# EAGLE design DriverOK-DemuxOK-VIA71 (EAGLE 9.6.2)
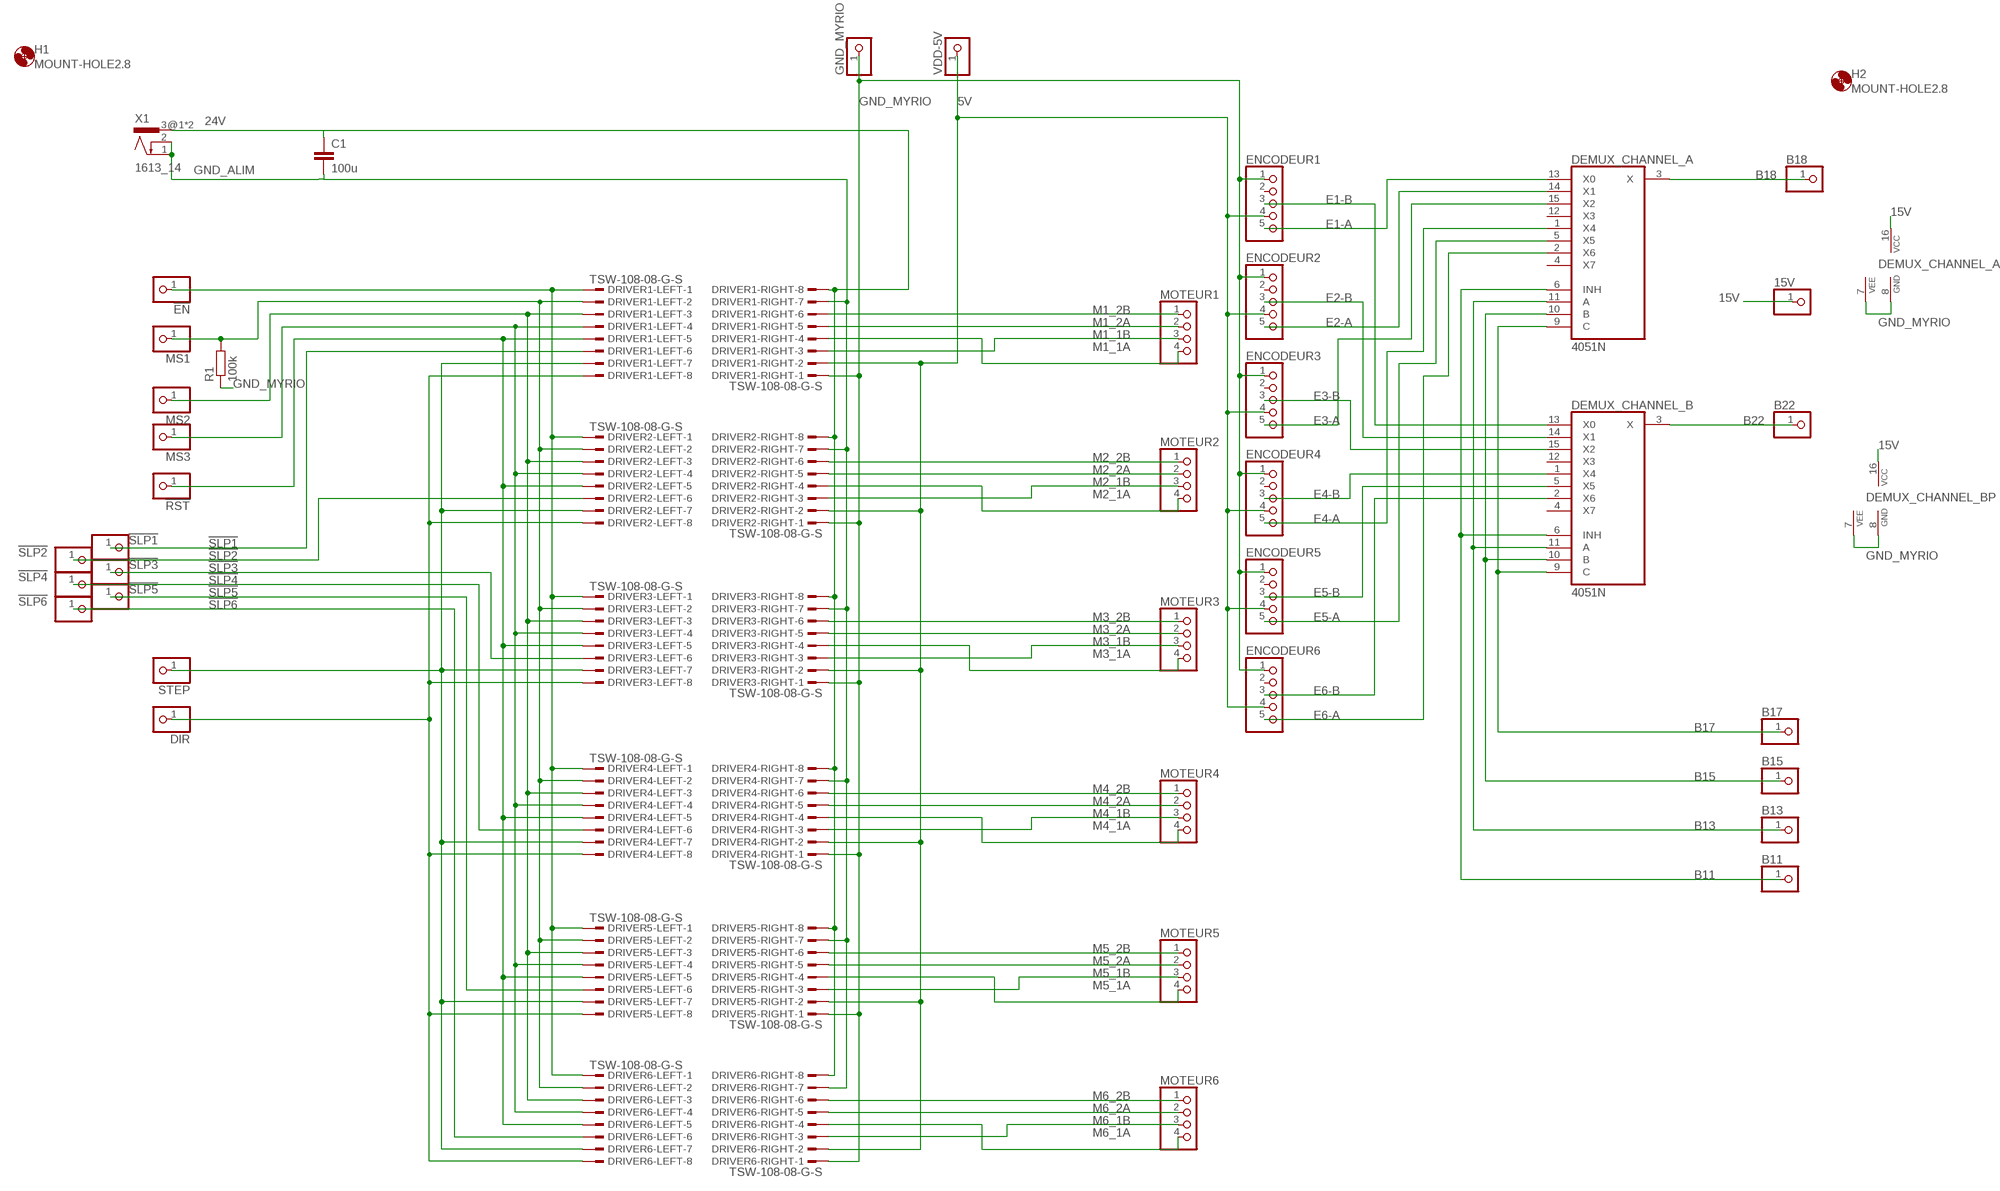
[diagram p0: schematic, sheet 1]

## Parts
15V  PINHD-1X1  [1X01]
!EN  PINHD-1X1  [1X01]
!RST  PINHD-1X1  [1X01]
!SLP1  PINHD-1X1  [1X01]
!SLP2  PINHD-1X1  [1X01]
!SLP3  PINHD-1X1  [1X01]
!SLP4  PINHD-1X1  [1X01]
!SLP5  PINHD-1X1  [1X01]
!SLP6  PINHD-1X1  [1X01]
B11  PINHD-1X1  [1X01]
B13  PINHD-1X1  [1X01]
B15  PINHD-1X1  [1X01]
B17  PINHD-1X1  [1X01]
B18  PINHD-1X1  [1X01]
B22  PINHD-1X1  [1X01]
C1  100u  C-EU025-025X050  [C025-025X050]
DEMUX_CHANNEL_A  4051N  [DIL16]
DEMUX_CHANNEL_B  4051N  [DIL16]
DIR  PINHD-1X1  [1X01]
DRIVER1-LEFT  TSW-108-08-G-S  [TSW-108-XX-G-S]
DRIVER1-RIGHT  TSW-108-08-G-S  [TSW-108-XX-G-S]
DRIVER2-LEFT  TSW-108-08-G-S  [TSW-108-XX-G-S]
DRIVER2-RIGHT  TSW-108-08-G-S  [TSW-108-XX-G-S]
DRIVER3-LEFT  TSW-108-08-G-S  [TSW-108-XX-G-S]
DRIVER3-RIGHT  TSW-108-08-G-S  [TSW-108-XX-G-S]
DRIVER4-LEFT  TSW-108-08-G-S  [TSW-108-XX-G-S]
DRIVER4-RIGHT  TSW-108-08-G-S  [TSW-108-XX-G-S]
DRIVER5-LEFT  TSW-108-08-G-S  [TSW-108-XX-G-S]
DRIVER5-RIGHT  TSW-108-08-G-S  [TSW-108-XX-G-S]
DRIVER6-LEFT  TSW-108-08-G-S  [TSW-108-XX-G-S]
DRIVER6-RIGHT  TSW-108-08-G-S  [TSW-108-XX-G-S]
ENCODEUR1  PINHD-1X5  [1X05]
ENCODEUR2  PINHD-1X5  [1X05]
ENCODEUR3  PINHD-1X5  [1X05]
ENCODEUR4  PINHD-1X5  [1X05]
ENCODEUR5  PINHD-1X5  [1X05]
ENCODEUR6  PINHD-1X5  [1X05]
GND_MYRIO  PINHD-1X1  [1X01]
H1  MOUNT-HOLE2.8  [2,8]
H2  MOUNT-HOLE2.8  [2,8]
MOTEUR1  PINHD-1X4  [1X04]
MOTEUR2  PINHD-1X4  [1X04]
MOTEUR3  PINHD-1X4  [1X04]
MOTEUR4  PINHD-1X4  [1X04]
MOTEUR5  PINHD-1X4  [1X04]
MOTEUR6  PINHD-1X4  [1X04]
MS1  PINHD-1X1  [1X01]
MS2  PINHD-1X1  [1X01]
MS3  PINHD-1X1  [1X01]
R1  100k  R-EU_0207/10  [0207/10]
STEP  PINHD-1X1  [1X01]
VDD-5V  PINHD-1X1  [1X01]
X1  1613_14  [1613_14]

## Nets
5V: DRIVER1-RIGHT.2 DRIVER2-RIGHT.2 DRIVER3-RIGHT.2 DRIVER4-RIGHT.2 DRIVER5-RIGHT.2 DRIVER6-RIGHT.2 ENCODEUR1.4 ENCODEUR2.4 ENCODEUR3.4 ENCODEUR4.4 ENCODEUR5.4 ENCODEUR6.4 VDD-5V.1
15V: 15V.1 DEMUX_CHANNEL_A.16(VCC) DEMUX_CHANNEL_B.16(VCC)
24V: C1.1 DRIVER1-RIGHT.8 DRIVER2-RIGHT.8 DRIVER3-RIGHT.8 DRIVER4-RIGHT.8 DRIVER5-RIGHT.8 DRIVER6-RIGHT.8 X1.3@1 X1.3@2
!ENABLE: !EN.1 DRIVER1-LEFT.1 DRIVER2-LEFT.1 DRIVER3-LEFT.1 DRIVER4-LEFT.1 DRIVER5-LEFT.1 DRIVER6-LEFT.1
!RESET: !RST.1 DRIVER1-LEFT.5 DRIVER2-LEFT.5 DRIVER3-LEFT.5 DRIVER4-LEFT.5 DRIVER5-LEFT.5 DRIVER6-LEFT.5
!SLP1: !SLP1.1 DRIVER1-LEFT.6
!SLP2: !SLP2.1 DRIVER2-LEFT.6
!SLP3: !SLP3.1 DRIVER3-LEFT.6
!SLP4: !SLP4.1 DRIVER4-LEFT.6
!SLP5: !SLP5.1 DRIVER5-LEFT.6
!SLP6: !SLP6.1 DRIVER6-LEFT.6
B11: B11.1 DEMUX_CHANNEL_A.6(INH) DEMUX_CHANNEL_B.6(INH)
B13: B13.1 DEMUX_CHANNEL_A.11(A) DEMUX_CHANNEL_B.11(A)
B15: B15.1 DEMUX_CHANNEL_A.10(B) DEMUX_CHANNEL_B.10(B)
B17: B17.1 DEMUX_CHANNEL_A.9(C) DEMUX_CHANNEL_B.9(C)
B18: B18.1 DEMUX_CHANNEL_A.3(X)
B22: B22.1 DEMUX_CHANNEL_B.3(X)
DIR: DIR.1 DRIVER1-LEFT.8 DRIVER2-LEFT.8 DRIVER3-LEFT.8 DRIVER4-LEFT.8 DRIVER5-LEFT.8 DRIVER6-LEFT.8
E1-A: DEMUX_CHANNEL_A.13(X0) ENCODEUR1.5
E1-B: DEMUX_CHANNEL_B.13(X0) ENCODEUR1.3
E2-A: DEMUX_CHANNEL_A.14(X1) ENCODEUR2.5
E2-B: DEMUX_CHANNEL_B.14(X1) ENCODEUR2.3
E3-A: DEMUX_CHANNEL_A.15(X2) ENCODEUR3.5
E3-B: DEMUX_CHANNEL_B.15(X2) ENCODEUR3.3
E4-A: DEMUX_CHANNEL_A.1(X4) ENCODEUR4.5
E4-B: DEMUX_CHANNEL_B.1(X4) ENCODEUR4.3
E5-A: DEMUX_CHANNEL_A.5(X5) ENCODEUR5.5
E5-B: DEMUX_CHANNEL_B.5(X5) ENCODEUR5.3
E6-A: DEMUX_CHANNEL_A.2(X6) ENCODEUR6.5
E6-B: DEMUX_CHANNEL_B.2(X6) ENCODEUR6.3
GND_ALIM: C1.2 DRIVER1-RIGHT.7 DRIVER2-RIGHT.7 DRIVER3-RIGHT.7 DRIVER4-RIGHT.7 DRIVER5-RIGHT.7 DRIVER6-RIGHT.7 X1.1 X1.2
GND_MYRIO: DEMUX_CHANNEL_A.7(VEE) DEMUX_CHANNEL_A.8(GND) DEMUX_CHANNEL_B.7(VEE) DEMUX_CHANNEL_B.8(GND) DRIVER1-RIGHT.1 DRIVER2-RIGHT.1 DRIVER3-RIGHT.1 DRIVER4-RIGHT.1 DRIVER5-RIGHT.1 DRIVER6-RIGHT.1 ENCODEUR1.1 ENCODEUR2.1 ENCODEUR3.1 ENCODEUR4.1 ENCODEUR5.1 ENCODEUR6.1 GND_MYRIO.1 R1.1
M1_1A: DRIVER1-RIGHT.4 MOTEUR1.4
M1_1B: DRIVER1-RIGHT.3 MOTEUR1.3
M1_2A: DRIVER1-RIGHT.5 MOTEUR1.2
M1_2B: DRIVER1-RIGHT.6 MOTEUR1.1
M2_1A: DRIVER2-RIGHT.4 MOTEUR2.4
M2_1B: DRIVER2-RIGHT.3 MOTEUR2.3
M2_2A: DRIVER2-RIGHT.5 MOTEUR2.2
M2_2B: DRIVER2-RIGHT.6 MOTEUR2.1
M3_1A: DRIVER3-RIGHT.4 MOTEUR3.4
M3_1B: DRIVER3-RIGHT.3 MOTEUR3.3
M3_2A: DRIVER3-RIGHT.5 MOTEUR3.2
M3_2B: DRIVER3-RIGHT.6 MOTEUR3.1
M4_1A: DRIVER4-RIGHT.4 MOTEUR4.4
M4_1B: DRIVER4-RIGHT.3 MOTEUR4.3
M4_2A: DRIVER4-RIGHT.5 MOTEUR4.2
M4_2B: DRIVER4-RIGHT.6 MOTEUR4.1
M5_1A: DRIVER5-RIGHT.4 MOTEUR5.4
M5_1B: DRIVER5-RIGHT.3 MOTEUR5.3
M5_2A: DRIVER5-RIGHT.5 MOTEUR5.2
M5_2B: DRIVER5-RIGHT.6 MOTEUR5.1
M6_1A: DRIVER6-RIGHT.4 MOTEUR6.4
M6_1B: DRIVER6-RIGHT.3 MOTEUR6.3
M6_2A: DRIVER6-RIGHT.5 MOTEUR6.2
M6_2B: DRIVER6-RIGHT.6 MOTEUR6.1
MS1: DRIVER1-LEFT.2 DRIVER2-LEFT.2 DRIVER3-LEFT.2 DRIVER4-LEFT.2 DRIVER5-LEFT.2 DRIVER6-LEFT.2 MS1.1 R1.2
MS2: DRIVER1-LEFT.3 DRIVER2-LEFT.3 DRIVER3-LEFT.3 DRIVER4-LEFT.3 DRIVER5-LEFT.3 DRIVER6-LEFT.3 MS2.1
MS3: DRIVER1-LEFT.4 DRIVER2-LEFT.4 DRIVER3-LEFT.4 DRIVER4-LEFT.4 DRIVER5-LEFT.4 DRIVER6-LEFT.4 MS3.1
STEP: DRIVER1-LEFT.7 DRIVER2-LEFT.7 DRIVER3-LEFT.7 DRIVER4-LEFT.7 DRIVER5-LEFT.7 DRIVER6-LEFT.7 STEP.1
Unconnected: DEMUX_CHANNEL_A.4(X7) DEMUX_CHANNEL_A.12(X3) DEMUX_CHANNEL_B.4(X7) DEMUX_CHANNEL_B.12(X3) ENCODEUR1.2 ENCODEUR2.2 ENCODEUR3.2 ENCODEUR4.2 ENCODEUR5.2 ENCODEUR6.2

## Library data of the parts
15V !EN !RST !SLP1-!SLP6 B11 B13 B15 B17 B18 B22 DIR GND_MYRIO MS1-MS3 STEP VDD-5V = pinhead:PINHD-1X1: PIN HEADER
C1 = rcl:C-EU: CAPACITOR, European symbol; SPICEPREFIX: C
DEMUX_CHANNEL_A DEMUX_CHANNEL_B = 40xx:4051: 8-channel ANALOG MULTIPLEXER
DRIVER1-LEFT DRIVER1-RIGHT DRIVER2-LEFT DRIVER2-RIGHT DRIVER3-LEFT DRIVER3-RIGHT DRIVER4-LEFT DRIVER4-RIGHT DRIVER5-LEFT DRIVER5-RIGHT DRIVER6-LEFT DRIVER6-RIGHT = con-samtec:TSW-108-*-G-S: THROUGH-HOLE .025" SQ POST HEADER Source: Samtec TSW.pdf; MF: Samtec Inc.; MPN: TSW-108-07-G-S
ENCODEUR1-ENCODEUR6 = pinhead:PINHD-1X5: PIN HEADER
H1 H2 = holes:MOUNT-HOLE: MOUNTING HOLE with drill center marker
MOTEUR1-MOTEUR6 = pinhead:PINHD-1X4: PIN HEADER
R1 = rcl:R-EU_: RESISTOR, European symbol; SPICEPREFIX: R
X1 = con-lumberg:1613_14: Power supply connectors / Netzgeräte-Steckverbinder Source: Data sheet <http://www.farnell.com/datasheets/1733496.pdf>; MF: LUMBERG; MPN: 1613 14; OC_FARNELL: 1243245

## Board
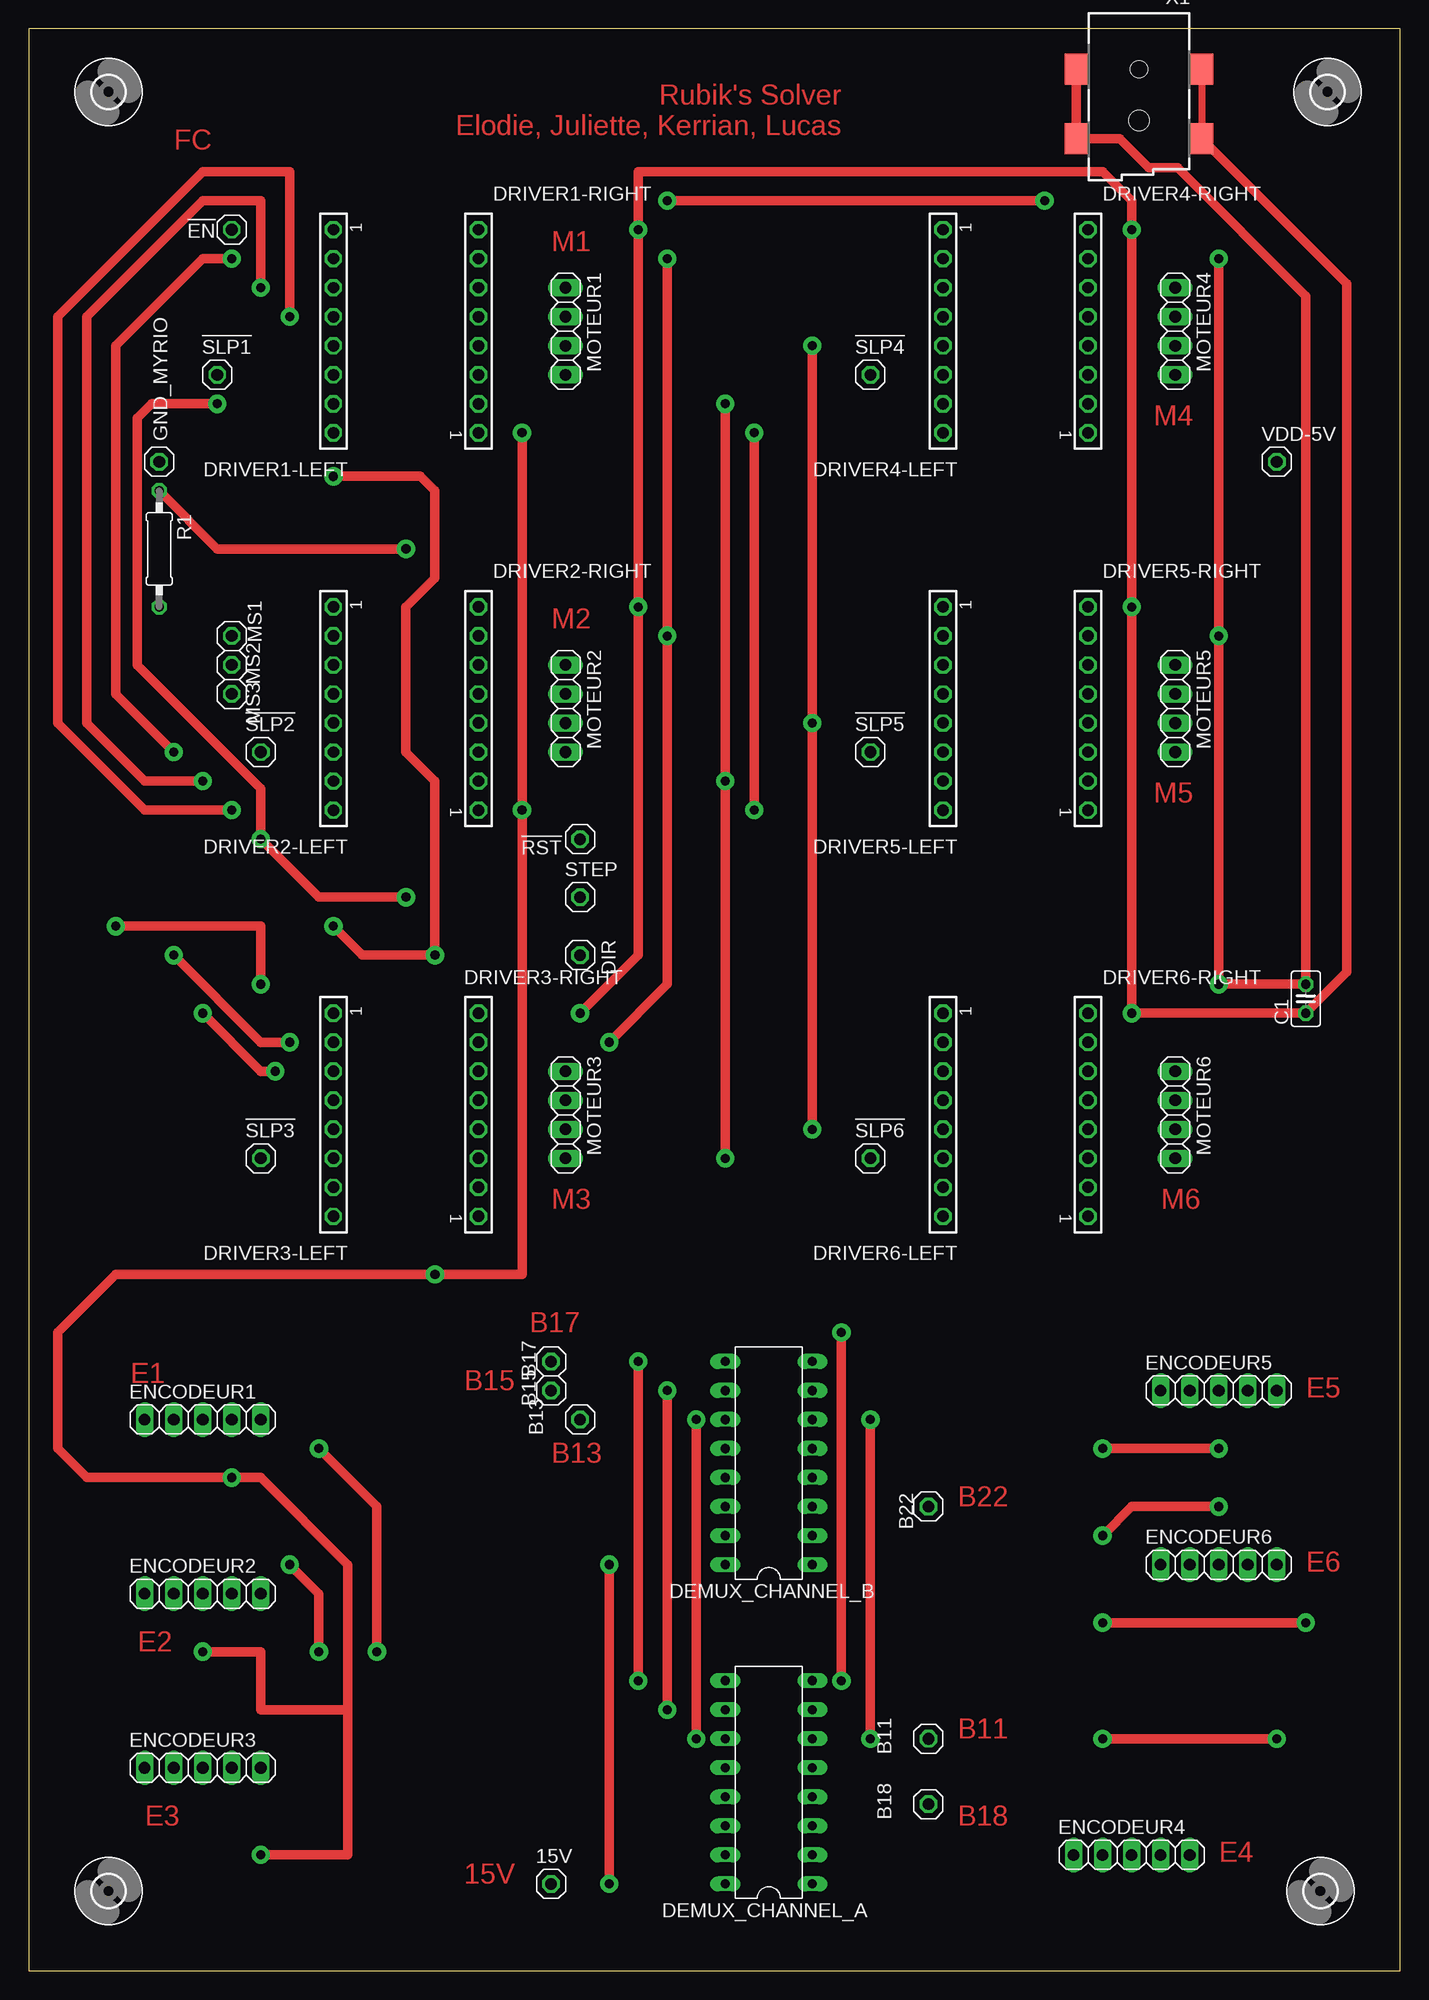
[diagram p1: board, top side]
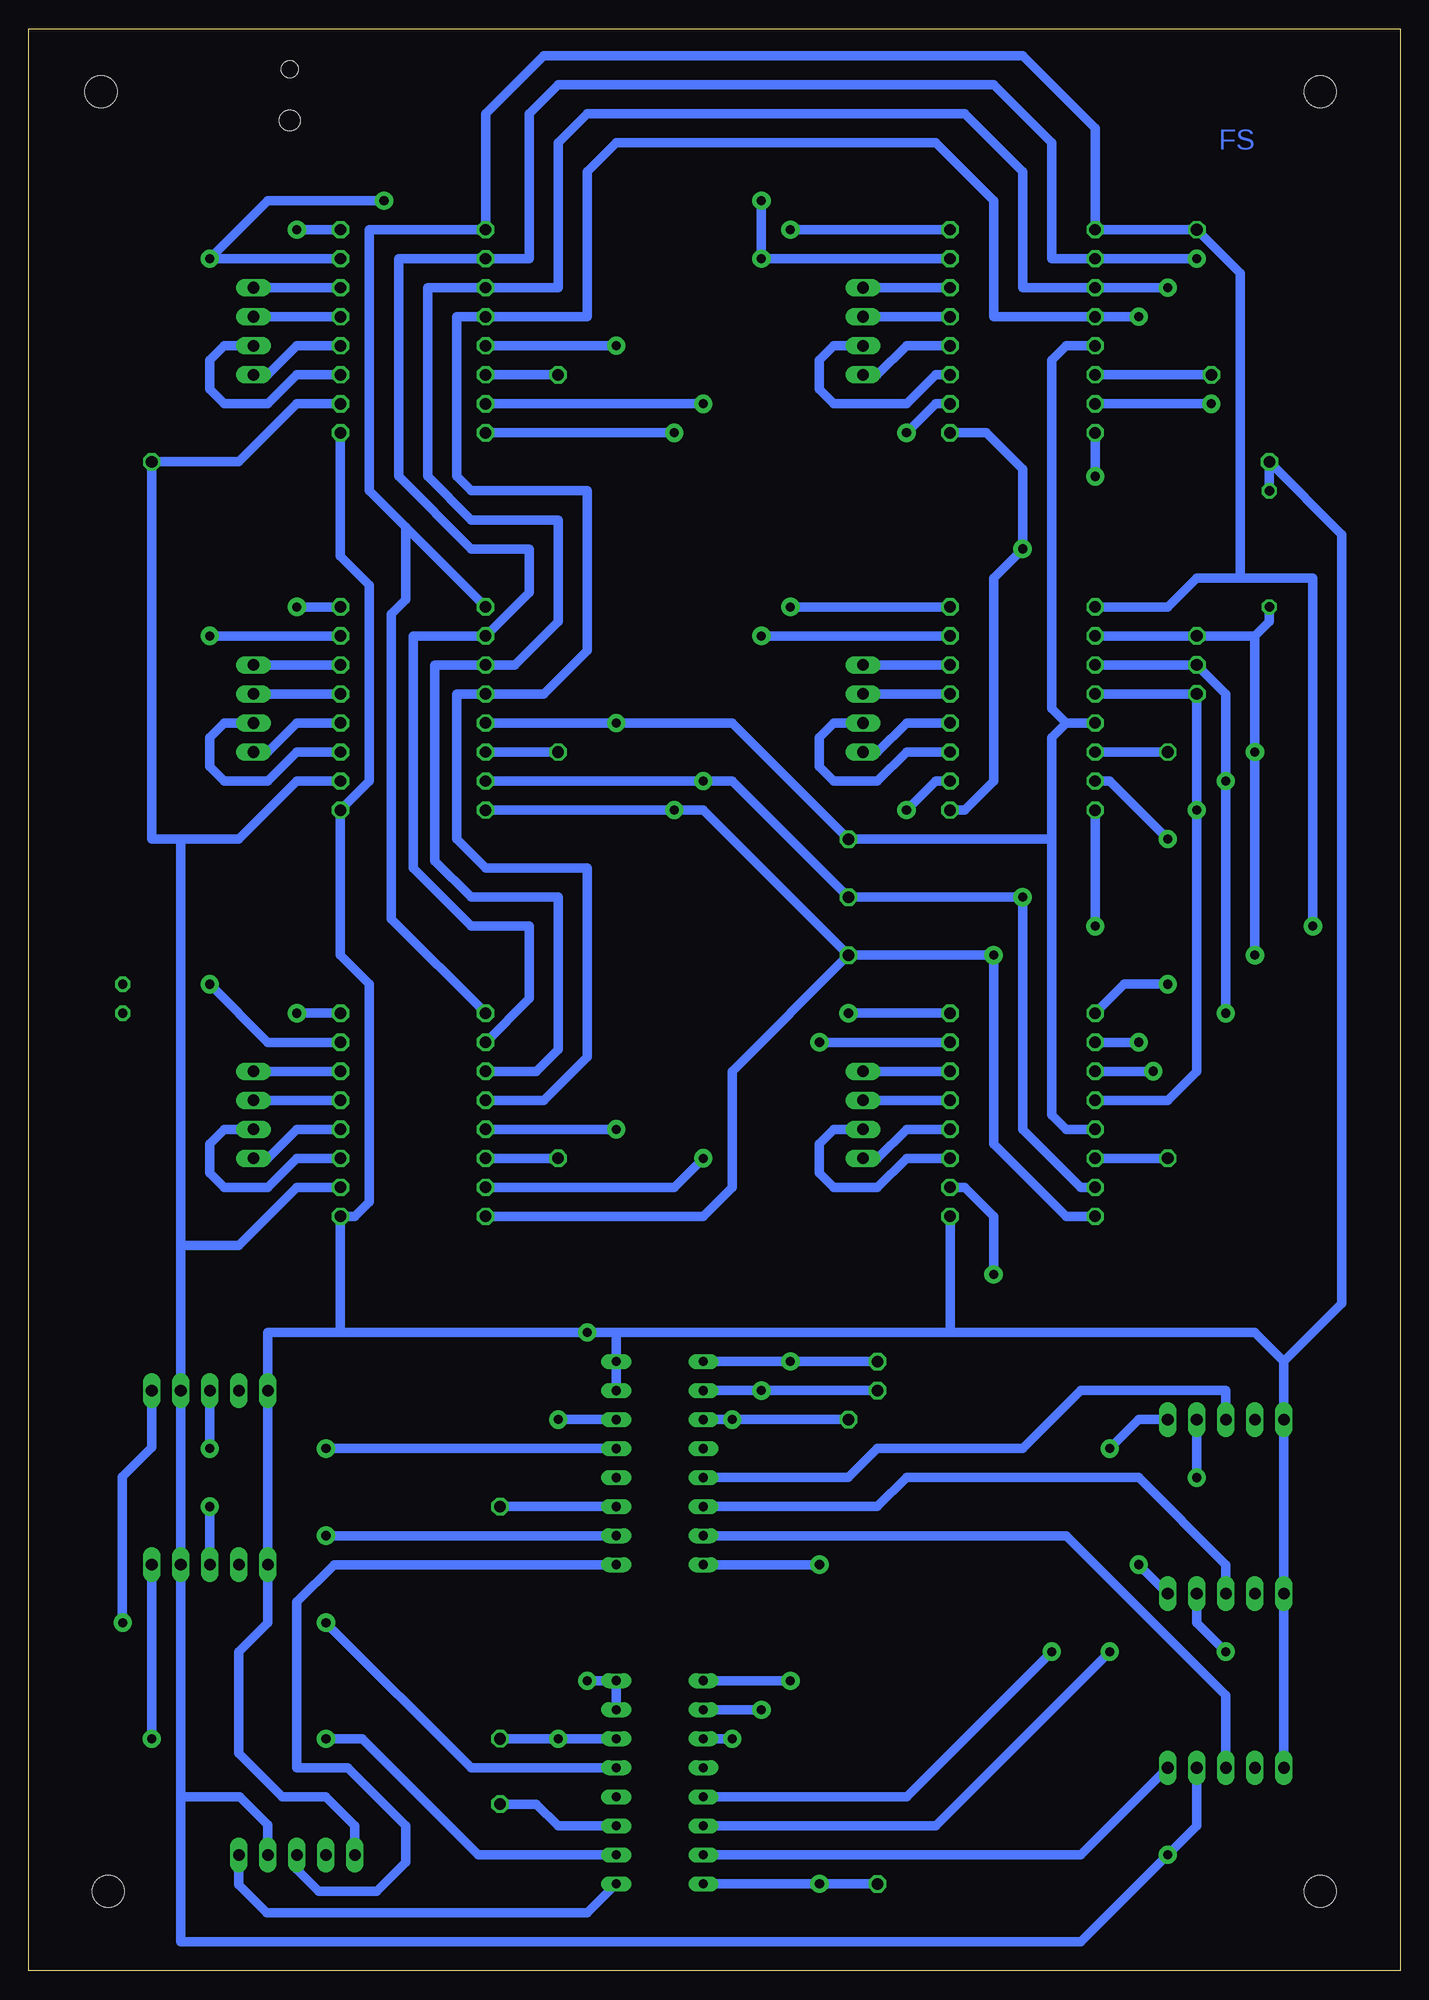
[diagram p2: board, bottom side, seen from below]

Size 120 x 170 mm. Coordinates in mm from the lower left corner, seen from the top.
Outline: 0,0 120,0 120,170 0,170 0,0
Copper layers (1*16): Top 0.035mm / dielectric 1.5mm / Bottom 0.035mm
Design rules "default": minimum track width 6mil, minimum drill 0.35mm, track to track 6mil, track to pad 6mil, pad to pad 6mil, via to via 6mil, smd to smd 6mil, copper to edge 40mil, drill to drill 6mil, minimum pad ring 10mil, minimum via ring 8mil, stop-mask expansion 4mil, vias tented up to drill 0mil, thermal gap 10mil

### Footprints (pad centres in the part's own frame; a part is rotated, then mirrored left to right if it is on the bottom)
1X01 = drill 1.016 octagon: 1 0,0
C025-025X050 = drill 0.813 octagon: 1 -1.27,0; 2 1.27,0
DIL16 = drill 0.813 long: 1 -8.89,-3.81; 2 -6.35,-3.81; 3 -3.81,-3.81; 4 -1.27,-3.81; 5 1.27,-3.81; 6 3.81,-3.81; 7 6.35,-3.81; 8 8.89,-3.81; 9 8.89,3.81; 10 6.35,3.81; 11 3.81,3.81; 12 1.27,3.81; 13 -1.27,3.81; 14 -3.81,3.81; 15 -6.35,3.81; 16 -8.89,3.81
TSW-108-XX-G-S = drill 1 pad 1.5 octagon: 1 8.89,0; 2 6.35,0; 3 3.81,0; 4 1.27,0; 5 -1.27,0; 6 -3.81,0; 7 -6.35,0; 8 -8.89,0
1X05 = drill 1.016 long: 1 -5.08,0; 2 -2.54,0; 3 0,0; 4 2.54,0; 5 5.08,0
2,8 = hole 2.8: 0,0
1X04 = drill 1.016 long: 1 -3.81,0; 2 -1.27,0; 3 1.27,0; 4 3.81,0
0207/10 = drill 0.813 octagon: 1 -5.08,0; 2 5.08,0
1613_14 = smd 2 x 2.7: 1 5.5,5; 2 5.5,11.1; 3@1 -5.5,11.1; 3@2 -5.5,5 | hole 1.5: 0,5 | hole 1.8: 0,9.5

### Placement (x,y rotation side)
15V  45.72,7.62 0 top
!EN  17.78,152.4 270 top
!RST  48.26,99.06 0 top
!SLP1  16.51,139.7 0 top
!SLP2  20.32,106.68 0 top
!SLP3  20.32,71.12 0 top
!SLP4  73.66,139.7 0 top
!SLP5  73.66,106.68 0 top
!SLP6  73.66,71.12 0 top
B11  78.74,20.32 0 top
B13  48.26,48.26 0 top
B15  45.72,50.8 0 top
B17  45.72,53.34 0 top
B18  78.74,14.61 0 top
B22  78.74,40.64 0 top
C1  111.76,85.09 90 top
DEMUX_CHANNEL_A  64.77,16.51 90 top
DEMUX_CHANNEL_B  64.77,44.45 90 top
DIR  48.26,88.9 270 top
DRIVER1-LEFT  26.67,143.51 90 top
DRIVER1-RIGHT  39.37,143.51 270 top
DRIVER2-LEFT  26.67,110.49 90 top
DRIVER2-RIGHT  39.37,110.49 270 top
DRIVER3-LEFT  26.67,74.93 90 top
DRIVER3-RIGHT  39.37,74.93 270 top
DRIVER4-LEFT  80.01,143.51 90 top
DRIVER4-RIGHT  92.71,143.51 270 top
DRIVER5-LEFT  80.01,110.49 90 top
DRIVER5-RIGHT  92.71,110.49 270 top
DRIVER6-LEFT  80.01,74.93 90 top
DRIVER6-RIGHT  92.71,74.93 270 top
ENCODEUR1  15.24,48.26 0 top
ENCODEUR2  15.24,33.02 0 top
ENCODEUR3  15.24,17.78 0 top
ENCODEUR4  96.52,10.16 0 top
ENCODEUR5  104.14,50.8 0 top
ENCODEUR6  104.14,35.56 0 top
GND_MYRIO  11.43,132.08 90 top
H1  6.99,164.47 0 top
H2  6.99,6.99 0 top
H3  MOUNT-HOLE2.8  [2,8]  113.67,164.47 0 top
H4  MOUNT-HOLE2.8  [2,8]  113.03,6.99 0 top
MOTEUR1  46.99,143.51 270 top
MOTEUR2  46.99,110.49 270 top
MOTEUR3  46.99,74.93 270 top
MOTEUR4  100.33,143.51 270 top
MOTEUR5  100.33,110.49 270 top
MOTEUR6  100.33,74.93 270 top
MS1  17.78,116.84 270 top
MS2  17.78,114.3 270 top
MS3  17.78,111.76 270 top
R1  11.43,124.46 270 top
STEP  48.26,93.98 0 top
VDD-5V  109.22,132.08 0 top
X1  97.16,171.45 180 top

### Tracks (layer width: path | path; a pad name or v marks a point on that pad's centre or on a via)
5V  (via drill 0.8 pad 1.6)
  Top 0.813: v20.32,10.16 27.94,10.16 27.94,22.86 | 27.94,22.86 27.94,35.56 20.32,43.18 v17.78,43.18 5.08,43.18 2.54,45.72 2.54,55.88 7.62,60.96 v35.56,60.96 43.18,60.96 v43.18,101.6 v43.18,134.62 | v15.24,27.94 20.32,27.94 20.32,22.86 27.94,22.86
  Bottom 0.813: ENCODEUR3.4 17.78,12.7 v20.32,10.16 27.94,2.54 106.68,2.54 106.68,15.24 | ENCODEUR1.4 v17.78,43.18 | ENCODEUR2.4 17.78,30.48 v15.24,27.94 | DRIVER4-RIGHT.2 96.52,137.16 101.6,132.08 VDD-5V.1 109.22,99.06 106.68,99.06 | 106.68,99.06 101.6,99.06 96.52,104.14 DRIVER5-RIGHT.2 | 106.68,99.06 106.68,63.5 | 106.68,63.5 101.6,63.5 96.52,68.58 DRIVER6-RIGHT.2 | v35.56,60.96 35.56,66.04 38.1,68.58 DRIVER3-RIGHT.2 | v43.18,101.6 40.64,104.14 DRIVER2-RIGHT.2 | v43.18,134.62 40.64,137.16 DRIVER1-RIGHT.2 | 106.68,15.24 ENCODEUR6.4 ENCODEUR5.4 106.68,63.5 | ENCODEUR4.4 99.06,12.79 101.51,15.24 106.68,15.24
15V  (via drill 0.8 pad 1.6)
  Top 0.813: v50.8,7.62 v50.8,35.56
  Bottom 0.813: 15V.1 v50.8,7.62 DEMUX_CHANNEL_A.16 | v50.8,35.56 DEMUX_CHANNEL_B.16
24V  (via drill 0.8 pad 1.6)
  Top 0.61: X1.3@2 X1.3@1
  Top 0.813: X1.3@1 115.36,147.65 115.36,87.42 C1.1 v96.52,83.82 v96.52,119.38 v96.52,152.4 96.52,154.94 93.98,157.48 53.34,157.48 v53.34,152.4 v53.34,119.38 53.34,88.9 v48.26,83.82
  Bottom 0.813: v96.52,83.82 DRIVER6-RIGHT.8 | v96.52,152.4 DRIVER4-RIGHT.8 | v96.52,119.38 DRIVER5-RIGHT.8 | v53.34,152.4 DRIVER1-RIGHT.8 | v48.26,83.82 DRIVER3-RIGHT.8 | v53.34,119.38 DRIVER2-RIGHT.8
!ENABLE  (via drill 0.8 pad 1.6)
  Top 0.813: v7.62,91.44 20.32,91.44 v20.32,86.36
  Bottom 0.813: 13.97,121.92 13.97,148.59 !EN.1 DRIVER1-LEFT.1 26.67,161.29 33.02,167.64 74.93,167.64 80.01,162.56 DRIVER4-LEFT.1 90.17,152.4 90.17,129.54 87,126.36 | DRIVER2-LEFT.1 20.32,119.38 17.78,121.92 13.97,121.92 | 13.97,121.92 7.62,121.92 v7.62,91.44 | v20.32,86.36 24.13,86.36 DRIVER3-LEFT.1 | 87,126.36 DRIVER5-LEFT.1 | 87,126.36 87,120.02 88.27,118.75 88.27,92.08 DRIVER6-LEFT.1
!RESET  (via drill 0.8 pad 1.6)
  Top 0.813: v68.58,73.66 v68.58,109.22 v68.58,142.24
  Bottom 0.813: DRIVER3-LEFT.5 29.21,73.66 30.48,74.93 30.48,99.06 | 30.48,99.06 30.48,107.95 29.21,109.22 | DRIVER2-LEFT.5 29.21,109.22 | 29.21,109.22 30.48,110.49 30.48,140.97 29.21,142.24 DRIVER1-LEFT.5 | 30.48,99.06 !RST.1 58.42,109.22 v68.58,109.22 DRIVER5-LEFT.5 | v68.58,73.66 DRIVER6-LEFT.5 | v68.58,142.24 DRIVER4-LEFT.5
!SLP1
  Bottom 0.813: !SLP1.1 DRIVER1-LEFT.6
!SLP2
  Bottom 0.813: !SLP2.1 DRIVER2-LEFT.6
!SLP3
  Bottom 0.813: !SLP3.1 DRIVER3-LEFT.6
!SLP4
  Bottom 0.813: !SLP4.1 DRIVER4-LEFT.6
!SLP5
  Bottom 0.813: !SLP5.1 DRIVER5-LEFT.6
!SLP6
  Bottom 0.813: !SLP6.1 DRIVER6-LEFT.6
B11  (via drill 0.8 pad 1.6)
  Top 0.813: v73.66,20.32 v73.66,48.26
  Bottom 0.813: DEMUX_CHANNEL_A.6 v73.66,20.32 B11.1 | v73.66,48.26 DEMUX_CHANNEL_B.6
B13  (via drill 0.8 pad 1.6)
  Top 0.813: v58.42,48.26 v58.42,20.32
  Bottom 0.813: DEMUX_CHANNEL_B.11 v58.42,48.26 B13.1 | v58.42,20.32 DEMUX_CHANNEL_A.11
B15  (via drill 0.8 pad 1.6)
  Top 0.813: v55.88,50.8 v55.88,22.86
  Bottom 0.813: DEMUX_CHANNEL_B.10 v55.88,50.8 B15.1 | v55.88,22.86 DEMUX_CHANNEL_A.10
B17  (via drill 0.8 pad 1.6)
  Top 0.813: v53.34,53.34 v53.34,25.4
  Bottom 0.813: DEMUX_CHANNEL_B.9 v53.34,53.34 B17.1 | v53.34,25.4 DEMUX_CHANNEL_A.9
B18
  Bottom 0.813: DEMUX_CHANNEL_A.3 73.66,12.7 75.56,14.61 B18.1
B22
  Bottom 0.813: DEMUX_CHANNEL_B.3 B22.1
DIR  (via drill 0.8 pad 1.6)
  Top 0.813: v26.67,91.44 29.21,88.9 v35.56,88.9 35.56,104.14 33.02,106.68 33.02,119.38 35.56,121.92 35.56,129.54 34.29,130.81 v26.67,130.81 | v63.5,101.6 v63.5,134.62
  Bottom 0.813: DIR.1 v35.56,88.9 35.56,72.39 29.21,66.04 DRIVER3-LEFT.8 | DIR.1 60.96,101.6 v63.5,101.6 DRIVER5-LEFT.8 | DIR.1 58.42,78.74 58.42,68.58 60.96,66.04 DRIVER6-LEFT.8 | v26.67,91.44 DRIVER2-LEFT.8 | v26.67,130.81 DRIVER1-LEFT.8 | v63.5,134.62 DRIVER4-LEFT.8
E1-A  (via drill 0.8 pad 1.6)
  Top 0.813: v25.4,45.72 30.48,40.64 v30.48,27.94
  Bottom 0.813: ENCODEUR1.5 22.86,48.26 v25.4,45.72 | v30.48,27.94 43.18,15.24 DEMUX_CHANNEL_A.13
E1-B
  Bottom 0.813: ENCODEUR1.3 15.24,50.8 27.94,50.8 33.02,45.72 45.72,45.72 48.26,43.18 DEMUX_CHANNEL_B.13
E2-A  (via drill 0.8 pad 1.6)
  Top 0.813: v22.86,35.56 25.4,33.02 v25.4,27.94
  Bottom 0.813: ENCODEUR2.5 v22.86,35.56 | v25.4,27.94 40.64,12.7 DEMUX_CHANNEL_A.14
E2-B
  Bottom 0.813: ENCODEUR2.3 15.24,35.56 22.86,43.18 43.18,43.18 45.72,40.64 DEMUX_CHANNEL_B.14
E3-A
  Bottom 0.813: ENCODEUR3.5 27.94,10.16 DEMUX_CHANNEL_A.15
E3-B
  Bottom 0.813: ENCODEUR3.3 15.24,24.13 29.21,38.1 DEMUX_CHANNEL_B.15
E4-A
  Bottom 0.813: DEMUX_CHANNEL_A.1 71.12,5.08 99.15,5.08 101.6,7.53 ENCODEUR4.5
E4-B
  Bottom 0.813: DEMUX_CHANNEL_B.1 93.25,35.56 96.52,32.29 96.52,17.78 92.08,17.78 87,12.7 87,9.53 89.53,6.99 94.61,6.99 96.52,8.89 ENCODEUR4.3
E5-A  (via drill 0.8 pad 1.6)
  Top 0.813: v93.98,30.48 v111.76,30.48
  Bottom 0.813: v93.98,30.48 81.28,17.78 DEMUX_CHANNEL_A.5 | ENCODEUR5.5 109.22,45.81 111.81,43.22 111.81,30.53 v111.76,30.48
E5-B  (via drill 0.8 pad 1.6)
  Top 0.813: v93.98,45.72 v104.14,45.72
  Bottom 0.813: DEMUX_CHANNEL_B.5 v93.98,45.72 | ENCODEUR5.3 v104.14,45.72
E6-A  (via drill 0.8 pad 1.6)
  Top 0.813: v93.98,20.32 v109.22,20.32
  Bottom 0.813: v93.98,20.32 90.81,20.32 80.64,10.16 DEMUX_CHANNEL_A.2 | v109.22,20.32 ENCODEUR6.5
E6-B  (via drill 0.8 pad 1.6)
  Top 0.813: v104.14,40.64 96.52,40.64 v93.98,38.1
  Bottom 0.813: DEMUX_CHANNEL_B.2 v93.98,38.1 | ENCODEUR6.3 v104.14,40.64
GND_ALIM  (via drill 0.8 pad 1.6)
  Top 0.813: X1.1 X1.2 95.47,160.35 98,157.81 100.55,157.81 111.76,146.59 C1.2 v104.14,86.36 v104.14,116.84 v104.14,149.86 | v50.8,81.28 55.88,86.36 v55.88,116.84 v55.88,149.86 | v88.9,154.94 v55.88,154.94
  Bottom 0.813: v104.14,86.36 99.06,81.28 DRIVER6-RIGHT.7 | DRIVER4-RIGHT.7 v104.14,149.86 99.06,154.94 v88.9,154.94 | v104.14,116.84 DRIVER5-RIGHT.7 | v55.88,154.94 v55.88,149.86 DRIVER1-RIGHT.7 | v55.88,116.84 DRIVER2-RIGHT.7 | v50.8,81.28 DRIVER3-RIGHT.7
GND_MYRIO  (via drill 0.8 pad 1.6)
  Top 0.813: v71.12,25.4 v71.12,55.88 | R1.1 16.51,124.46 v33.02,124.46
  Bottom 0.813: ENCODEUR3.1 ENCODEUR2.1 ENCODEUR1.1 10.16,53.34 | 10.16,53.34 12.7,55.88 39.37,55.88 | 39.37,55.88 68.58,55.88 | 68.58,55.88 v71.12,55.88 92.71,55.88 | DEMUX_CHANNEL_B.7 DEMUX_CHANNEL_B.8 68.58,55.88 | DEMUX_CHANNEL_A.7 DEMUX_CHANNEL_A.8 v71.12,25.4 | R1.1 GND_MYRIO.1 5.08,125.73 5.08,58.42 10.16,53.34 | 92.71,55.88 DRIVER6-RIGHT.1 91.44,66.04 90.17,67.31 90.17,86.36 92.71,88.9 DRIVER5-RIGHT.1 90.17,104.14 90.17,121.28 92.71,123.83 DRIVER4-RIGHT.1 | DRIVER3-RIGHT.1 39.37,55.88 | DRIVER1-RIGHT.1 36.2,134.62 33.02,131.44 v33.02,124.46 35.56,121.92 35.56,104.14 38.1,101.6 DRIVER2-RIGHT.1 | 92.71,55.88 99.06,55.88 ENCODEUR5.1 ENCODEUR6.1 99.06,30.48 101.6,27.94 101.6,19.05 97.79,15.24 93.98,15.24 91.44,12.7 ENCODEUR4.1
M1_1A
  Bottom 0.813: DRIVER1-RIGHT.4 43.18,142.24 45.72,139.7 MOTEUR1.4
M1_1B
  Bottom 0.813: DRIVER1-RIGHT.3 40.64,139.7 43.18,137.16 49.53,137.16 50.8,138.43 50.8,140.97 49.53,142.24 MOTEUR1.3
M1_2A
  Bottom 0.813: DRIVER1-RIGHT.5 MOTEUR1.2
M1_2B
  Bottom 0.813: DRIVER1-RIGHT.6 MOTEUR1.1
M2_1A
  Bottom 0.813: DRIVER2-RIGHT.4 43.18,109.22 45.72,106.68 MOTEUR2.4
M2_1B
  Bottom 0.813: DRIVER2-RIGHT.3 43.18,106.68 45.72,104.14 49.53,104.14 50.8,105.41 50.8,107.95 49.53,109.22 MOTEUR2.3
M2_2A
  Bottom 0.813: DRIVER2-RIGHT.5 MOTEUR2.2
M2_2B
  Bottom 0.813: DRIVER2-RIGHT.6 MOTEUR2.1
M3_1A
  Bottom 0.813: DRIVER3-RIGHT.4 43.18,73.66 45.72,71.12 MOTEUR3.4
M3_1B
  Bottom 0.813: DRIVER3-RIGHT.3 43.18,71.12 45.72,68.58 49.53,68.58 50.8,69.85 50.8,72.39 49.53,73.66 MOTEUR3.3
M3_2A
  Bottom 0.813: DRIVER3-RIGHT.5 MOTEUR3.2
M3_2B
  Bottom 0.813: DRIVER3-RIGHT.6 MOTEUR3.1
M4_1A
  Bottom 0.813: MOTEUR4.4 99.06,139.7 96.52,142.24 DRIVER4-RIGHT.4
M4_1B
  Bottom 0.813: DRIVER4-RIGHT.3 96.52,139.7 99.06,137.16 102.87,137.16 104.14,138.43 104.14,140.97 102.87,142.24 MOTEUR4.3
M4_2A
  Bottom 0.813: DRIVER4-RIGHT.5 MOTEUR4.2
M4_2B
  Bottom 0.813: DRIVER4-RIGHT.6 MOTEUR4.1
M5_1A
  Bottom 0.813: DRIVER5-RIGHT.4 96.52,109.22 99.06,106.68 MOTEUR5.4
M5_1B
  Bottom 0.813: DRIVER5-RIGHT.3 96.52,106.68 99.06,104.14 102.87,104.14 104.14,105.41 104.14,107.95 102.87,109.22 MOTEUR5.3
M5_2A
  Bottom 0.813: DRIVER5-RIGHT.5 MOTEUR5.2
M5_2B
  Bottom 0.813: DRIVER5-RIGHT.6 MOTEUR5.1
M6_1A
  Bottom 0.813: MOTEUR6.4 99.06,71.12 96.52,73.66 DRIVER6-RIGHT.4
M6_1B
  Bottom 0.813: DRIVER6-RIGHT.3 96.52,71.12 99.06,68.58 102.87,68.58 104.14,69.85 104.14,72.39 102.87,73.66 MOTEUR6.3
M6_2A
  Bottom 0.813: DRIVER6-RIGHT.5 MOTEUR6.2
M6_2B
  Bottom 0.813: DRIVER6-RIGHT.6 MOTEUR6.1
MS1  (via drill 0.8 pad 1.6)
  Top 0.813: v12.7,88.9 20.32,81.28 v22.86,81.28 | v12.7,106.68 7.62,111.76 7.62,142.24 15.24,149.86 v17.78,149.86
  Bottom 0.813: R1.2 11.43,118.11 12.7,116.84 | 12.7,116.84 MS1.1 DRIVER2-LEFT.2 | DRIVER3-LEFT.2 v22.86,81.28 | 12.7,116.84 v12.7,106.68 v12.7,88.9 | v17.78,149.86 DRIVER1-LEFT.2 30.48,149.86 30.48,160.02 35.56,165.1 73.66,165.1 76.2,162.56 76.2,149.86 DRIVER4-LEFT.2 87.63,149.86 87.63,130.81 81.28,124.46 76.2,124.46 76.2,120.65 DRIVER5-LEFT.2 86.36,116.84 86.36,96.52 81.28,91.44 76.2,91.44 76.2,85.09 DRIVER6-LEFT.2
MS2  (via drill 0.8 pad 1.6)
  Top 0.813: v15.24,83.82 20.32,78.74 v21.59,78.74 | v15.24,104.14 10.16,104.14 5.08,109.22 5.08,144.78 15.24,154.94 20.32,154.94 v20.32,147.32
  Bottom 0.813: DRIVER2-LEFT.3 MS2.1 15.24,111.76 v15.24,104.14 v15.24,83.82 | DRIVER3-LEFT.3 v21.59,78.74 | v20.32,147.32 DRIVER1-LEFT.3 33.02,147.32 33.02,157.48 38.1,162.56 71.12,162.56 73.66,160.02 73.66,147.32 DRIVER4-LEFT.3 85.09,147.32 85.09,130.81 81.28,127 73.66,127 73.66,118.11 77.47,114.3 DRIVER5-LEFT.3 84.45,114.3 84.45,97.16 81.28,93.98 73.66,93.98 73.66,80.64 75.56,78.74 DRIVER6-LEFT.3
MS3  (via drill 0.8 pad 1.6)
  Top 0.813: v17.78,101.6 10.16,101.6 2.54,109.22 2.54,144.78 15.24,157.48 22.86,157.48 v22.86,144.78
  Bottom 0.813: DRIVER2-LEFT.4 MS3.1 v17.78,101.6 17.78,78.74 20.32,76.2 DRIVER3-LEFT.4 | v22.86,144.78 DRIVER1-LEFT.4 35.56,144.78 35.56,154.94 40.64,160.02 68.58,160.02 71.12,157.48 71.12,144.78 DRIVER4-LEFT.4 82.55,144.78 82.55,130.81 81.28,129.54 71.12,129.54 71.12,115.57 74.93,111.76 DRIVER5-LEFT.4 82.55,111.76 82.55,99.06 80.01,96.52 71.12,96.52 71.12,80.01 74.93,76.2 DRIVER6-LEFT.4
STEP  (via drill 0.8 pad 1.6)
  Top 0.813: v33.02,93.98 25.4,93.98 v20.32,99.06 20.32,103.5 9.53,114.3 9.53,135.89 10.79,137.16 v16.51,137.16 | v60.96,137.16 v60.96,104.14 v60.96,71.12
  Bottom 0.813: DRIVER3-LEFT.7 27.94,68.58 33.02,73.66 v33.02,93.98 STEP.1 58.42,104.14 v60.96,104.14 DRIVER5-LEFT.7 | v20.32,99.06 25.4,104.14 DRIVER2-LEFT.7 | v16.51,137.16 DRIVER1-LEFT.7 | v60.96,137.16 DRIVER4-LEFT.7 | v60.96,71.12 63.5,68.58 DRIVER6-LEFT.7

### Text on the board
Top: Rubik's Solver / Elodie, Juliette, Kerrian, Lucas | FC | M1 | M4 | M2 | M5 | M3 | M6 | B17 | E1 | B15 | E5 | B13 | B22 | E6 | E2 | B11 | E3 | B18 | E4 | 15V
Bottom: FS